# Altium schematic sheet 主板.schdoc
size 435 x 308 mm
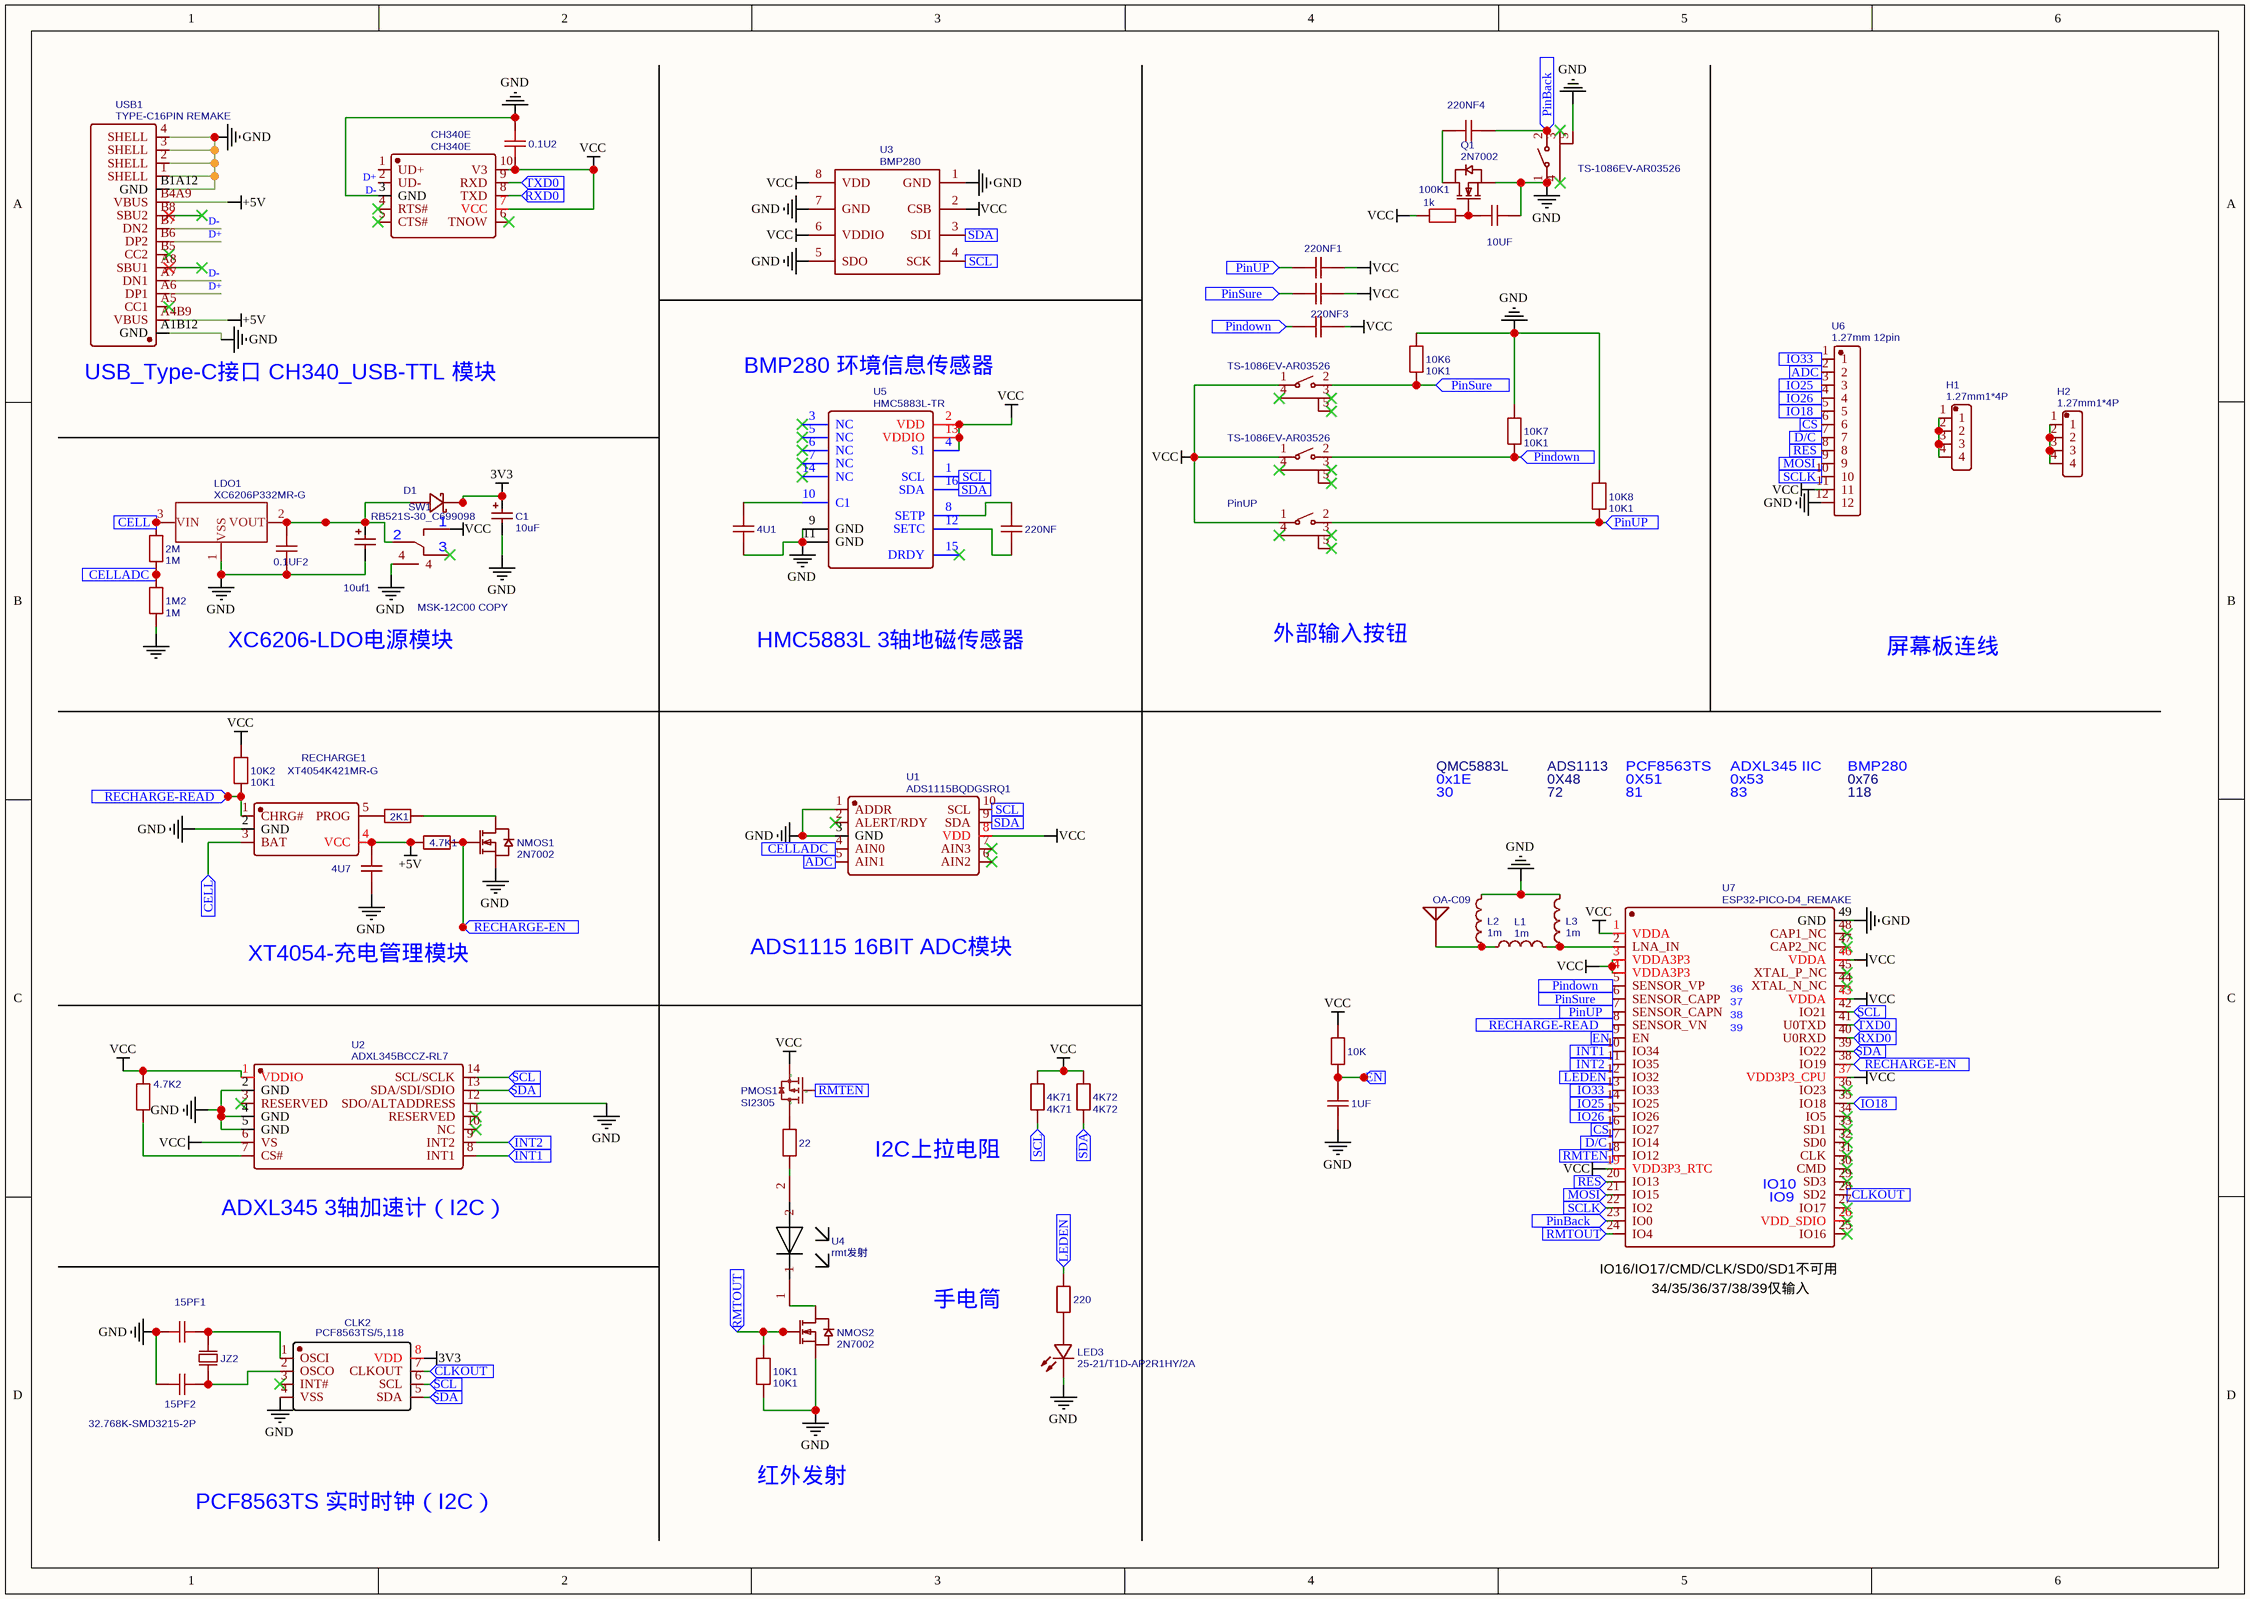
[diagram p0: 主板.schdoc]

## Parts
0.1U2  0.1u  [C0603]  (value not drawn)
0.1UF2  0.1u  [C0603]  (value not drawn)
1  OA-C09  [OA-C09]
1M2  1M  [R0603]
1UF  1uF  [C0603]  (value not drawn)
2K1  2k1  [R0603]  (value not drawn)
2M  1M  [R0603]
4.7K1  4.7K  [R0603]  (value not drawn)
4.7K2  4.7K  [R0603]  (value not drawn)
4K71  4K71  [R0603]
4K72  4K72  [R0603]
4U1  0.1u  [C0603]  (value not drawn)
4U7  4.7uf  [C0603]  (value not drawn)
10K  10kΩ  [R0603]  (value not drawn)
10K1  10K1  [R0603]
10K2  10K1  [R0603]
10K6  10K1  [R0603]
10K7  10K1  [R0603]
10K8  10K1  [R0603]
10UF  0.1u  [C0603]  (value not drawn)
15PF1  15PF  [C0603]  (value not drawn)
15PF2  15PF2  [C0603]  (value not drawn)
22  1001  [R0603]  (value not drawn)
100K1  1k  [R0603]
220  10K2  [R0603]  (value not drawn)
220NF  0.1u  [C0603]  (value not drawn)
220NF1  0.1u  [C0603]  (value not drawn)
220NF2  0.1u  [C0603]  (value not drawn)
220NF3  0.1u  [C0603]  (value not drawn)
220NF4  0.1u  [C0603]  (value not drawn)
BACK1  TS-1086EV-AR03526  [SW-SMD_TS-1086EV-AR03526]
C1  10uF  [CAP-SMD_L3.2-W1.6-RD-C7171]
C5  10uf1  [CAP-SMD_L3.2-W1.6-RD-C7171]
CH340E  CH340E  [MSOP-10_L3.0-W3.0-P0.50-LS5.0-BL]
CLK2  PCF8563TS/5,118  [TSSOP-8_L3.0-W3.0-P0.65-LS4.9-BL]
D1  RB521S-30_C699098  [SOD-523_L1.2-W0.8-LS1.6-RD]
DOWN1  TS-1086EV-AR03526  [SW-SMD_TS-1086EV-AR03526]
H1  1.27mm1*4P  [1.27MM1*4P]
H2  1.27mm1*4P  [1.27MM1*4P]
JZ2  32.768K-SMD3215-2P  [CRYSTAL-SMD_L3.2-W1.5-2]
L1  1m  [L0603]
L2  1m  [L0603]
L3  1m  [L0603]
LDO1  XC6206P332MR-G  [SEEED-SOT-23]
LED3  25-21/T1D-AP2R1HY/2A  [LED1206-R-RD]
NMOS1  2N7002  [SOT-23_L2.9-W1.3-P0.95-LS2.4-BR]
NMOS2  2N7002  [SOT-23_L2.9-W1.3-P0.95-LS2.4-BR]
PMOS1  SI2305  [SOT-23-3_L2.9-W1.3-P1.90-LS2.4-BR]
Q1  2N7002  [SOT-23_L2.9-W1.3-P0.95-LS2.4-BR]
RECHARGE1  XT4054K421MR-G  [SOT-23-5_L3.0-W1.7-P0.95-LS2.8-BL]
SURE1  TS-1086EV-AR03526  [SW-SMD_TS-1086EV-AR03526]
SW1  MSK-12C00 COPY  [MSK-12C00]
U1  ADS1115BQDGSRQ1  [VSSOP-10_L3.0-W3.0-P0.50-LS4.9-BL]
U2  ADXL345BCCZ-RL7  [LGA-14_L5.0-W3.0-P0.80-BL]
U3  BMP280  [SENSOR-TH_BMP280-BL]
U4  rmt发射  [RMT发射]
U5  HMC5883L-TR  [LGA-16_L3.0-W3.0-P0.50-BL_SQ]
U6  1.27mm 12pin  [1.27MM 12P]
U7  ESP32-PICO-D4_REMAKE  [ESP32 PICOD4]
UP1  PinUP  [SW-SMD_TS-1086EV-AR03526]
USB1  TYPE-C16PIN REMAKE  [USB-C-SMD_TYPE-C16PIN]

## Ports
ADC (in), CELL (in), CELLADC (in), CLKOUT (in), CS (in), D/C (in), EN (in), INT1 (in), INT2 (in), IO18 (in), IO25 (in), IO26 (in), IO33 (in), LEDEN (in), MOSI (in), PinBack (in), Pindown (in), PinSure (in), PinUP (in), RECHARGE-EN (in), RECHARGE-READ (in), RES (in), RMTEN (in), RMTOUT (in), RXD0 (in), SCL (in), SCLK (in), SDA (in), TXD0 (in)

## Nets
3V3: C1.1 CLK2.8(VDD) D1.1(K)
+5V: 4.7K1.1 4U7.2 RECHARGE1.4(VCC) USB1.A4B9(VBUS) USB1.B4A9(VBUS)
GND: 0.1U2.2 0.1UF2.1 1M2.1 1UF.2 4U1.1 4U7.1 10K1.1 10K6.2 10K7.2 10K8.2 10UF.2 15PF1.1 15PF2.1 BACK1.1 BACK1.5 C1.2 C5.2 CH340E.3(GND) CLK2.4(VSS) L2.2 L3.2 LDO1.1(VSS) LED3.2(K) NMOS1.2(S) NMOS2.2(S) Q1.2(S) RECHARGE1.2(GND) SW1.4 U1.1(ADDR) U1.3(GND) U2.2(GND) U2.4(GND) U2.5(GND) U2.12(SDO/ALTADDRESS) U3.1(GND) U3.5(SDO) U3.7(GND) U5.9(GND) U5.11(GND) U6.12 U7.49(GND) USB1.1(SHELL) USB1.2(SHELL) USB1.3(SHELL) USB1.4(SHELL) USB1.A1B12(GND) USB1.B1A12(GND)
VCC: 0.1U2.1 4.7K2.2 4K71.2 4K72.2 10K.2 10K2.2 100K1.1 220NF1.2 220NF2.2 220NF3.2 CH340E.7(VCC) CH340E.10(V3) DOWN1.1 PMOS1.2(S) SURE1.1 SW1.1 U1.8(VDD) U2.1(VDDIO) U2.6(VS) U3.2(CSB) U3.6(VDDIO) U3.8(VDD) U5.2(VDD) U5.4(S1) U5.13(VDDIO) U6.11 U7.1(VDDA) U7.3(VDDA3P3) U7.4(VDDA3P3) U7.19(VDD3P3_RTC) U7.37(VDD3P3_CPU) U7.43(VDDA) U7.46(VDDA) UP1.1
ADC: U1.5(AIN1) U6.2 ; port ADC
CELL: 2M.2 LDO1.3(VIN) RECHARGE1.3(BAT) ; port CELL
CELLADC: 1M2.2 2M.1 U1.4(AIN0) ; port CELLADC
CLKOUT: CLK2.7(CLKOUT) U7.28(SD2) ; port CLKOUT
CS: U6.6 U7.16(IO27) ; port CS
D+: CH340E.1(UD+) USB1.A6(DP1) USB1.B6(DP2)
D-: CH340E.2(UD-) USB1.A7(DN1) USB1.B7(DN2)
D/C: U6.7 U7.17(IO14) ; port D/C
EN: 1UF.1 10K.1 U7.9(EN) ; port EN
INT1: U2.8(INT1) U7.10(IO34) ; port INT1
INT2: U2.9(INT2) U7.11(IO35) ; port INT2
IO18: U6.5 U7.35(IO18) ; port IO18
IO25: U6.3 U7.14(IO25) ; port IO25
IO26: U6.4 U7.15(IO26) ; port IO26
IO33: U6.1 U7.13(IO33) ; port IO33
LEDEN: 220.2 U7.12(IO32) ; port LEDEN
MOSI: U6.9 U7.21(IO15) ; port MOSI
PinBack: 220NF4.1 BACK1.2 U7.23(IO0) ; port PinBack
Pindown: 10K7.1 220NF3.1 DOWN1.2 U7.5(SENSOR_VP) ; port Pindown
PinSure: 10K6.1 220NF2.1 SURE1.2 U7.6(SENSOR_CAPP) ; port PinSure
PinUP: 10K8.1 220NF1.1 U7.7(SENSOR_CAPN) UP1.2 ; port PinUP
RECHARGE-EN: 4.7K1.2 NMOS1.1(G) U7.38(IO19) ; port RECHARGE-EN
RECHARGE-READ: 10K2.1 RECHARGE1.1(CHRG#) U7.8(SENSOR_VN) ; port RECHARGE-READ
RES: U6.8 U7.20(IO13) ; port RES
RMTEN: PMOS1.1(G) U7.18(IO12) ; port RMTEN
RMTOUT: 10K1.2 NMOS2.1(G) U7.24(IO4) ; port RMTOUT
RXD0: CH340E.8(TXD) U7.40(U0RXD) ; port RXD0
SCL: 4K71.1 CLK2.6(SCL) U1.10(SCL) U2.14(SCL/SCLK) U3.4(SCK) U5.1(SCL) U7.42(IO21) ; port SCL
SCLK: U6.10 U7.22(IO2) ; port SCLK
SDA: 4K72.1 CLK2.5(SDA) U1.9(SDA) U2.13(SDA/SDI/SDIO) U3.3(SDI) U5.16(SDA) U7.39(IO22) ; port SDA
TXD0: CH340E.9(RXD) U7.41(U0TXD) ; port TXD0
Net0.1UF2_2: 0.1UF2.2 C5.1 D1.2(A) LDO1.2(VOUT) SW1.2
Net1_1: 1.1 L1.1 L2.1
Net2K1_1: 2K1.1 RECHARGE1.5(PROG)
Net2K1_2: 2K1.2 NMOS1.3(D)
Net4.7K2_1: 4.7K2.1 U2.7(CS#)
Net4U1_2: 4U1.2 U5.10(C1)
Net10UF_1: 10UF.1 100K1.2 Q1.1(G)
Net15PF1_2: 15PF1.2 CLK2.1(OSCI) JZ2.2(OSC2)
Net15PF2_2: 15PF2.2 CLK2.2(OSCO) JZ2.1(OSC1)
Net22_1: 22.1 PMOS1.3(D)
Net22_2: 22.2 U4.2
Net220_1: 220.1 LED3.1(A)
Net220NF4_2: 220NF4.2 Q1.3(D)
Net220NF_1: 220NF.1 U5.12(SETC)
Net220NF_2: 220NF.2 U5.8(SETP)
NetH1_1: H1.1 H1.2 H1.3 H1.4
NetH2_1: H2.1 H2.2 H2.3 H2.4
NetL1_2: L1.2 L3.1 U7.2(LNA_IN)
NetNMOS2_3: NMOS2.3(D) U4.1

Not connected (* = marked no-connect by the designer): BACK1 3* 4*; CH340E 4(RTS#)* 5(CTS#)* 6(TNOW)*; CLK2 3(INT#)*; DOWN1 3* 4* 5*; SURE1 3* 4* 5*; SW1 3*; U1 2(ALERT/RDY)* 6(AIN2)* 7(AIN3)*; U2 3(RESERVED)* 10(NC)* 11(RESERVED)*; U5 3(NC)* 5(NC)* 6(NC)* 7(NC)* 14(NC)* 15(DRDY)*; U7 25(IO16)* 26(VDD_SDIO)* 27(IO17)* 29(SD3)* 30(CMD)* 31(CLK)* 32(SD0)* 33(SD1)* 34(IO5)* 36(IO23)* 44(XTAL_N_NC)* 45(XTAL_P_NC)* 47(CAP2_NC)* 48(CAP1_NC)*; UP1 3* 4* 5*; USB1 A5(CC1)* A8(SBU1)* B5(CC2)* B8(SBU2)*

## Notes on the sheet
- (near U5) BMP280 环境信息传感器
- (near USB1) USB_Type-C接口 CH340_USB-TTL 模块
- XC6206-LDO电源模块
- HMC5883L 3轴地磁传感器
- 外部输入按钮
- 屏幕板连线
- QMC5883L
- ADS1113
- PCF8563TS
- ADXL345 IIC
- BMP280
- 30
- 0x1E
- 72
- 0X48
- 81
- 0X51
- 83
- 0x53
- 118
- 0x76
- XT4054-充电管理模块
- ADS1115 16BIT ADC模块
- (near U7) 36
- (near U7) 37
- (near U7) 38
- (near U7) 39
- I2C上拉电阻
- (near U2) ADXL345 3轴加速计（I2C）
- (near U7) IO10
- (near U7) IO9
- (near U7) IO16/IO17/CMD/CLK/SD0/SD1不可用
- (near U7) 34/35/36/37/38/39仅输入
- 手电筒
- 红外发射
- PCF8563TS 实时时钟（I2C）

## Library data of the parts
0.1U2 0.1UF2 4U1 10UF 220NF 220NF1-220NF4 = 0.1u: nameAlias: Value(F); Contributor: LCEDA_Lib; spicePre: C; spiceSymbolName: C_0603_US
1 = OA-C09: Contributor: Bobbi; spicePre: A; spiceSymbolName: OA-C09
1M2 2M = 1M: nameAlias: Value(Ω); Contributor: LCEDA_Lib; spicePre: R; spiceSymbolName: R_0603_EU
1UF = 1uF: BOM_Manufacturer: Taiyo Yuden; BOM_Manufacturer Part: TMK107BJ105KA-T; nameAlias: Capacitance; Contributor: LCSC; BOM_Supplier: LCSC; BOM_Supplier Part: C92828; BOM_JLCPCB Part Class: Extended Part; spicePre: C; spiceSymbolName: TMK107BJ105KA-T
2K1 = 2k1: nameAlias: Value(Ω); Contributor: LCEDA_Lib; spicePre: R; spiceSymbolName: R_0603_EU
4.7K1 = 4.7K: nameAlias: Value(Ω); Contributor: LCEDA_Lib; spicePre: R; spiceSymbolName: R_0603_EU
4.7K2 = 4.7K: BOM_Manufacturer: SANYEAR(叁叶源); BOM_Manufacturer Part: SY0603DD30KP; nameAlias: Resistance; Contributor: LCSC; BOM_Supplier: LCSC; BOM_Supplier Part: C2763744; BOM_JLCPCB Part Class: Extended Part; spicePre: R; spiceSymbolName: SY0603DD30KP
4K71 = 4K71: nameAlias: Value(Ω); Contributor: LCEDA_Lib; spicePre: R; spiceSymbolName: R_0603_EU
4K72 = 4K72: nameAlias: Value(Ω); Contributor: LCEDA_Lib; spicePre: R; spiceSymbolName: R_0603_EU
4U7 = 4.7uf: nameAlias: Value(F); Contributor: LCEDA_Lib; spicePre: C; spiceSymbolName: C_0603_US
10K = 10kΩ: BOM_Manufacturer: VISHAY(威世); BOM_Manufacturer Part: PCAN0603E49R9BST5; nameAlias: Resistance; Contributor: LCSC; BOM_Supplier: LCSC; BOM_Supplier Part: C2073666; BOM_JLCPCB Part Class: Extended Part; spicePre: R; spiceSymbolName: PCAN0603E49R9BST5
10K1 10K2 10K6-10K8 = 10K1: nameAlias: Value(Ω); Contributor: LCEDA_Lib; spicePre: R; spiceSymbolName: R_0603_EU
15PF1 = 15PF: nameAlias: Value(F); Contributor: LCEDA_Lib; spicePre: C; spiceSymbolName: C_0603_US
15PF2 = 15PF2: nameAlias: Value(F); Contributor: LCEDA_Lib; spicePre: C; spiceSymbolName: C_0603_US
22 = 1001: nameAlias: Value(Ω); Contributor: LCEDA_Lib; spicePre: R; spiceSymbolName: R_0603_EU
100K1 = 1k: nameAlias: Value(Ω); Contributor: LCEDA_Lib; spicePre: R; spiceSymbolName: R_0603_EU
220 = 10K2: nameAlias: Value(Ω); Contributor: LCEDA_Lib; spicePre: R; spiceSymbolName: R_0603_EU
BACK1 DOWN1 SURE1 = TS-1086EV-AR03526: BOM_Manufacturer: XUNPU; Contributor: LCSC; BOM_Supplier: LCSC; BOM_Supplier Part: C720474; BOM_Manufacturer Part: TS-1086EV-AR03526; BOM_JLCPCB Part Class: Extended Part; spicePre: S; spiceSymbolName: TS-1086EV-AR03526
C1 = 10uF: BOM_Manufacturer: AVX; BOM_Manufacturer Part: TAJA106K016RNJ; nameAlias: Capacitance; BOM_Supplier: LCSC; BOM_Supplier Part: C7171; BOM_JLCPCB Part Class: Basic Part; spicePre: C; spiceSymbolName: TAJA106K016RNJ
C5 = 10uf1: BOM_Manufacturer: AVX; BOM_Manufacturer Part: TAJA106K016RNJ; nameAlias: Capacitance; BOM_Supplier: LCSC; BOM_Supplier Part: C7171; BOM_JLCPCB Part Class: Basic Part; spicePre: C; spiceSymbolName: TAJA106K016RNJ
CH340E = CH340E: BOM_Manufacturer: WCH; subpart_no: 1; BOM_Supplier: LCSC; BOM_Manufacturer Part: CH340E; BOM_Supplier Part: C99652; BOM_JLCPCB Part Class: Extended Part; spicePre: U; spiceSymbolName: CH340E
CLK2 = PCF8563TS/5,118: BOM_Manufacturer: NXP; BOM_Supplier: LCSC; BOM_Manufacturer Part: PCF8563TS/5,118; BOM_Supplier Part: C27397; BOM_JLCPCB Part Class: Extended Part; spicePre: U; spiceSymbolName: PCF8563TS/5,118
D1 = RB521S-30_C699098: BOM_Manufacturer: Yangzhou Yangjie Elec Tech; Contributor: LCSC; BOM_Supplier: LCSC; BOM_Supplier Part: C699098; BOM_Manufacturer Part: RB521S-30; BOM_JLCPCB Part Class: Extended Part; spicePre: D; spiceSymbolName: RB521S-30_C699098
H1 H2 = 1.27mm1*4P: BOM_Manufacturer: ReliaPro; BOM_Manufacturer Part: 1.27mm1*12P Straight Headers  Pins; Contributor: CyTech; BOM_Supplier Part: C28953; BOM_Supplier: LCSC; image: http://image.lceda.cn/szlcsc/C28953.jpg; spicePre: H; spiceSymbolName: 1.27mm1*4P
JZ2 = 32.768K-SMD3215-2P: BOM_Manufacturer: null; Contributor: LCSC; BOM_Supplier: LCSC; BOM_Supplier Part: C9900005513; BOM_Manufacturer Part: 32.768k-SMD3215-2P; BOM_JLCPCB Part Class: Extended Part; spicePre: U; spiceSymbolName: 32.768K-SMD3215-2P
L1-L3 = 1m: nameAlias: Value(H); Contributor: LCEDA_Lib; spicePre: L; spiceSymbolName: L0603_US
LDO1 = XC6206P332MR-G: description: SMD PMIC;LDO;Vin 6V;3.3V;200mA;Without En;1-Ch; sourceId: sIGDBzxv5; timeStamp: 1448004460; BOM_Manufacturer Part: XC6206P332MR-G; spicePre: U; spiceSymbolName: XC6206P332MR-G
LED3 = 25-21/T1D-AP2R1HY/2A: BOM_Manufacturer: EVERLIGHT; BOM_Supplier: LCSC; BOM_Manufacturer Part: 25-21/T1D-AP2R1HY/2A; BOM_Supplier Part: C83915; BOM_JLCPCB Part Class: Extended Part; spicePre: L; spiceSymbolName: 25-21/T1D-AP2R1HY/2A
NMOS1 NMOS2 Q1 = 2N7002: BOM_Manufacturer: Nexperia; BOM_Manufacturer Part: 2N7002,215; BOM_Paste Type: expand; Contributor: LCEDA_Lib; BOM_Supplier: LCSC; image: //image.lceda.cn/szlcsc/C65189.jpg; BOM_Supplier Part: C65189; spicePre: Q; spiceSymbolName: 2N7002
PMOS1 = SI2305: BOM_Manufacturer: Hottech; Contributor: LCSC; BOM_Supplier: LCSC; BOM_Manufacturer Part: SI2305; BOM_Supplier Part: C181088; BOM_JLCPCB Part Class: Extended Part; spicePre: Q; spiceSymbolName: SI2305
RECHARGE1 = XT4054K421MR-G: BOM_Manufacturer: NATLINEAR; Contributor: LCSC; BOM_Supplier: LCSC; BOM_Manufacturer Part: XT4054K421MR-G; BOM_Supplier Part: C141405; BOM_JLCPCB Part Class: Extended Part; spicePre: U; spiceSymbolName: XT4054K421MR-G
SW1 = MSK-12C00 COPY: Contributor: funwun; BOM_Supplier: 英尚微; spicePre: S; spiceSymbolName: MSK-12C00 COPY
U1 = ADS1115BQDGSRQ1: BOM_Manufacturer: TI(德州仪器); Contributor: lcsc; BOM_Supplier: LCSC; BOM_Supplier Part: C2868291; BOM_Manufacturer Part: ADS1115BQDGSRQ1; link: https://atta.szlcsc.comnull; spicePre: U; spiceSymbolName: ADS1115BQDGSRQ1
U2 = ADXL345BCCZ-RL7: BOM_Manufacturer: ADI; BOM_Supplier: LCSC; BOM_Manufacturer Part: ADXL345BCCZ-RL7; BOM_Supplier Part: C9667; BOM_JLCPCB Part Class: Extended Part; spicePre: U; spiceSymbolName: ADXL345BCCZ-RL7
U3 = BMP280: BOM_Manufacturer: Bosch; BOM_Supplier: LCSC; BOM_Manufacturer Part: BMP280; BOM_Supplier Part: C83291; BOM_JLCPCB Part Class: Extended Part; spicePre: U; spiceSymbolName: BMP280
U4 = rmt发射: Contributor: ThunderStorm0411; spicePre: U; spiceSymbolName: rmt发射
U5 = HMC5883L-TR: BOM_Manufacturer: Honeywell; BOM_Supplier: LCSC; BOM_Manufacturer Part: HMC5883L-TR; BOM_Supplier Part: C15640; BOM_JLCPCB Part Class: Extended Part; spicePre: U; spiceSymbolName: HMC5883L-TR
U6 = 1.27mm 12pin: Contributor: ThunderStorm0411; spicePre: U; spiceSymbolName: 1.27mm 12pin
U7 = ESP32-PICO-D4_REMAKE: BOM_Manufacturer: Espressif Systems; Contributor: LCSC; BOM_Supplier: LCSC; BOM_Supplier Part: C193707; BOM_Manufacturer Part: ESP32-PICO-D4; BOM_JLCPCB Part Class: Extended Part; Frequency: -; spicePre: U; spiceSymbolName: ESP32-PICO-D4_REMAKE
UP1 = PinUP: BOM_Manufacturer: XUNPU; BOM_Manufacturer Part: TS-1086EV-AR03526; Contributor: LCSC; BOM_Supplier: LCSC; BOM_Supplier Part: C720474; BOM_JLCPCB Part Class: Extended Part; spicePre: S; spiceSymbolName: TS-1086EV-AR03526
USB1 = TYPE-C16PIN REMAKE: BOM_Manufacturer: SHOU HAN; Contributor: LCSC; BOM_Supplier: LCSC; BOM_Supplier Part: C393939; BOM_Manufacturer Part: TYPE-C16PIN; BOM_JLCPCB Part Class: Extended Part; spicePre: U; spiceSymbolName: TYPE-C16PIN REMAKE